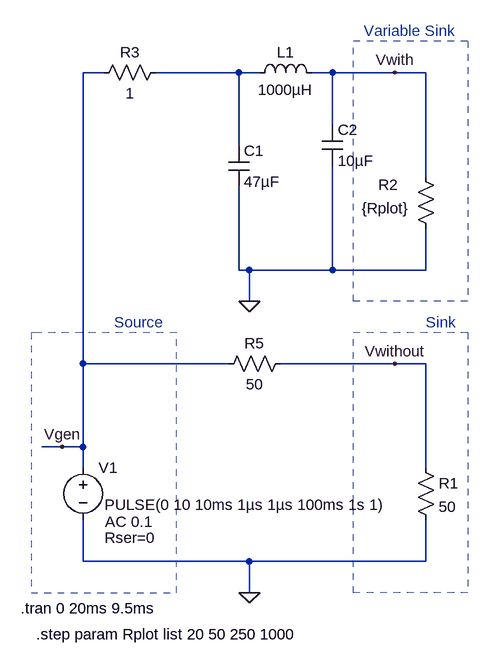
[diagram p0: schematic Filter-CLC-Time Domain.asc]
Filter-CLC-Time Domain.asc, the LTspice schematic file:
Version 4
SHEET 1 1348 680
WIRE 0 -368 -32 -368
WIRE 208 -368 80 -368
WIRE 240 -368 208 -368
WIRE 352 -368 320 -368
WIRE 448 -368 352 -368
WIRE 496 -368 448 -368
WIRE 352 -288 352 -368
WIRE 208 -256 208 -368
WIRE 496 -208 496 -368
WIRE 208 -64 208 -192
WIRE 224 -64 208 -64
WIRE 352 -64 352 -224
WIRE 352 -64 224 -64
WIRE 496 -64 496 -128
WIRE 496 -64 352 -64
WIRE 224 -16 224 -64
WIRE -32 80 -32 -368
WIRE 192 80 -32 80
WIRE 448 80 272 80
WIRE 496 80 448 80
WIRE -64 208 -96 208
WIRE -32 208 -32 80
WIRE -32 208 -64 208
WIRE -32 240 -32 208
WIRE 496 240 496 80
WIRE -32 384 -32 320
WIRE 224 384 -32 384
WIRE 496 384 496 320
WIRE 496 384 224 384
WIRE 224 432 224 384
FLAG 224 432 0
FLAG 448 80 Vwithout
FLAG -64 208 Vgen
FLAG 224 -16 0
FLAG 448 -368 Vwith
SYMBOL voltage -32 224 R0
WINDOW 123 34 99 Left 2
WINDOW 39 33 124 Left 2
WINDOW 3 33 73 Left 2
SYMATTR Value2 AC 0.1
SYMATTR SpiceLine Rser=0
SYMATTR InstName V1
SYMATTR Value PULSE(0 10 10ms 1µs 1µs 100ms 1s 1)
SYMBOL res 480 224 R0
SYMATTR InstName R1
SYMATTR Value 50
SYMBOL res 288 64 R90
WINDOW 0 0 56 VBottom 2
WINDOW 3 32 56 VTop 2
SYMATTR InstName R5
SYMATTR Value 50
SYMBOL res 480 -224 R0
WINDOW 0 -57 29 Left 2
WINDOW 3 -83 65 Left 2
SYMATTR InstName R2
SYMATTR Value {Rplot}
SYMBOL cap 336 -288 R0
SYMATTR InstName C2
SYMATTR Value 10µF
SYMATTR SpiceLine Rser=0.1 Lser=18nH
SYMBOL res 96 -384 R90
WINDOW 0 0 56 VBottom 2
WINDOW 3 32 56 VTop 2
SYMATTR InstName R3
SYMATTR Value 1
SYMBOL ind 224 -352 R270
WINDOW 0 32 56 VTop 2
WINDOW 3 5 56 VBottom 2
SYMATTR InstName L1
SYMATTR Value 1000µH
SYMBOL cap 192 -256 R0
SYMATTR InstName C1
SYMATTR Value 47µF
SYMATTR SpiceLine Rser=0.5 Lser=10nH
TEXT -128 456 Left 2 !.tran 0 20ms 9.5ms
TEXT 16 16 Left 2 ;Source
TEXT 496 16 Left 2 ;Sink
TEXT 400 -432 Left 2 ;Variable Sink
TEXT -104 496 Left 2 !.step param Rplot list 20 50 250 1000
LINE Normal 112 32 -96 32 2
LINE Normal 112 432 112 32 2
LINE Normal -112 432 112 432 2
LINE Normal -112 32 -112 432 2
LINE Normal -96 32 -112 32 2
LINE Normal -96 32 -96 32 2
LINE Normal 384 432 384 32 2
LINE Normal 560 32 560 432 2
LINE Normal 560 32 384 32 2
LINE Normal 560 32 560 32 2
LINE Normal 560 432 384 432 2
LINE Normal 560 432 560 432 2
LINE Normal 384 -16 384 -416 2
LINE Normal 560 -416 560 -16 2
LINE Normal 560 -416 384 -416 2
LINE Normal 560 -416 560 -416 2
LINE Normal 560 -16 384 -16 2
LINE Normal 560 -16 560 -16 2

The netlist it stands for:
* Filter-CLC-Time Domain.asc
V1 Vgen 0 PULSE(0 10 10ms 1µs 1µs 100ms 1s 1) AC 0.1 Rser=0
R1 Vwithout 0 50
R5 Vwithout Vgen 50
R2 Vwith 0 {Rplot}
C2 Vwith 0 10µF Rser=0.1 Lser=18nH
R3 N001 Vgen 1
L1 N001 Vwith 1000µH
C1 N001 0 47µF Rser=0.5 Lser=10nH
.tran 0 20ms 9.5ms
* Source
* Sink
* Variable Sink
.step param Rplot list 20 50 250 1000
.backanno
.end